# EAGLE design M_C_ext_main_cp2102N (EAGLE 9.6.2)
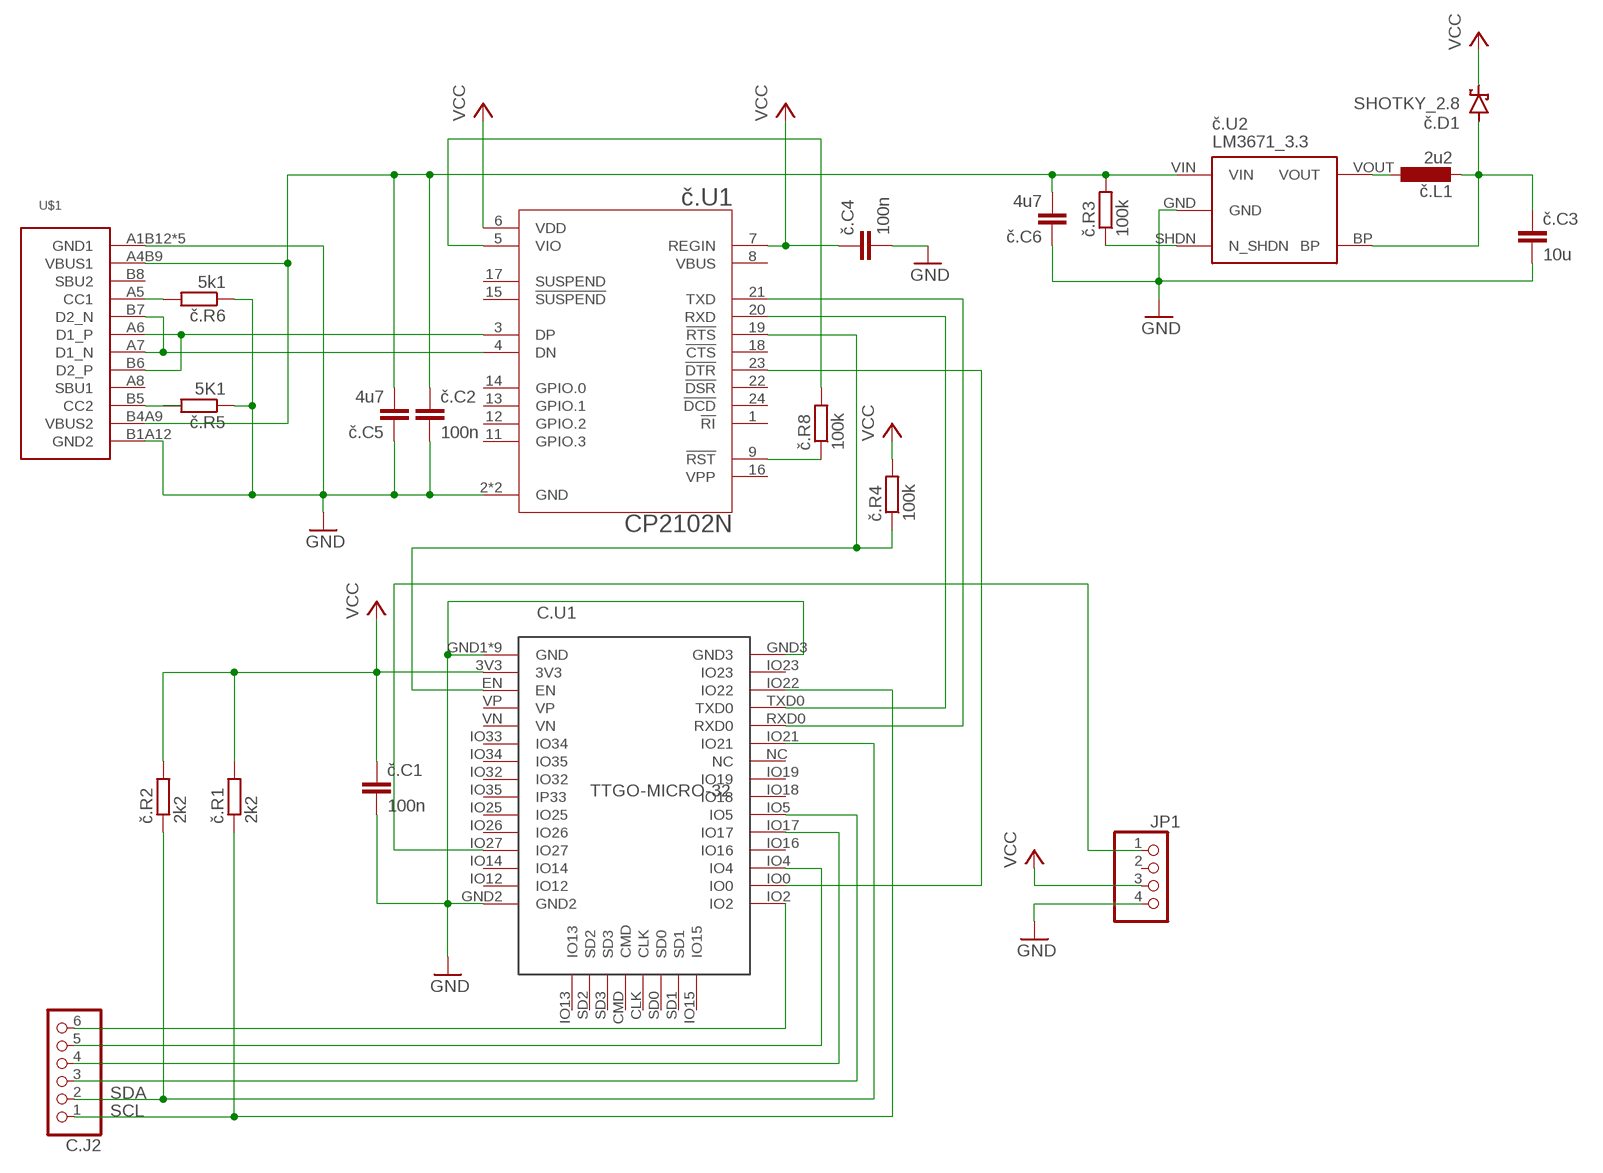
[diagram p0: schematic, sheet 1]

## Parts
C.J2  PINHD-1X6  [1X06]
C.U1  TTGO-MICRO-32  [TTGO-MICRO-32]
JP1  PINHD-1X4  [1X04]
U$1  USB-C  [USB-C]
č.C1  100n  C-EUC0603  [C0603]
č.C2  100n  C-EUC0603  [C0603]
č.C3  10u  C-EUC0805  [C0805]
č.C4  100n  C-EUC0603  [C0603]
č.C5  4u7  C-EUC0603  [C0603]
č.C6  4u7  C-EUC0603  [C0603]
č.D1  SHOTKY_2.8  [SHOTKY_2.8]
č.L1  2u2  L-EUL3230M  [L3230M]
č.R1  2k2  R-EU_R0603  [R0603]
č.R2  2k2  R-EU_R0603  [R0603]
č.R3  100k  R-EU_R0603  [R0603]
č.R4  100k  R-EU_R0603  [R0603]
č.R5  5K1  R-EU_R0603  [R0603]
č.R6  5k1  R-EU_R0603  [R0603]
č.R8  100k  R-EU_R0603  [R0603]
č.U1  CP2102N  CP2104-F03-GM  [QFN50P400X400X80-25N]
č.U2  LM3671_3.3  STABILISER_APE8865  [SOT32-5]

## Nets
GND: C.U1.GND1(GND) C.U1.GND2 C.U1.GND3 C.U1.GND4(GND) C.U1.GND5(GND) C.U1.GND6(GND) C.U1.GND7(GND) C.U1.GND8(GND) C.U1.GND9(GND) C.U1.GND10(GND) C.U1.GND11(GND) JP1.4 U$1.A1B12(GND1) U$1.B1A12(GND2) U$1.SH1(GND1) U$1.SH2(GND1) U$1.SH3(GND1) U$1.SH4(GND1) č.C1.2 č.C2.2 č.C3.2 č.C4.2 č.C5.1 č.C6.1 č.R5.1 č.R6.1 č.U1.2(GND) č.U1.25(GND) č.U2.GND
N$1: U$1.A7(D1_N) U$1.B7(D2_N) č.U1.4(DN)
N$2: U$1.A6(D1_P) U$1.B6(D2_P) č.U1.3(DP)
N$3: U$1.A5(CC1) č.R6.2
N$4: U$1.B5(CC2) č.R5.2
N$5: č.C3.1 č.D1.A č.L1.2 č.U2.BP
N$6: C.J2.6 C.U1.IO2
N$7: C.U1.IO27 JP1.1
N$8: č.R8.2 č.U1.5(VIO)
N$10: č.L1.1 č.U2.VOUT
N$11: č.R3.1 č.U2.SHDN(N_SHDN)
N$12: C.J2.5 C.U1.IO4
N$13: C.J2.4 C.U1.IO17
N$14: C.J2.3 C.U1.IO5
N$16: č.R8.1 č.U1.9(!RST!)
PROG: C.U1.IO0 č.U1.23(!DTR)
RESET: C.U1.EN č.R4.1 č.U1.19(!RTS)
RX: C.U1.TXD0 č.U1.20(RXD)
SCL: C.J2.1 C.U1.IO22 č.R1.1
SDA: C.J2.2 C.U1.IO21 č.R2.1
TX: C.U1.RXD0 č.U1.21(TXD)
VCC: C.U1.3V3 JP1.3 č.C1.1 č.C4.1 č.D1.K(C) č.R1.2 č.R2.2 č.R4.2 č.U1.6(VDD) č.U1.7(REGIN)
VUSB: U$1.A4B9(VBUS1) U$1.B4A9(VBUS2) č.C2.1 č.C5.2 č.C6.2 č.R3.2 č.U2.VIN
Unconnected: C.U1.CLK C.U1.CMD C.U1.IO12 C.U1.IO13 C.U1.IO14 C.U1.IO15 C.U1.IO16 C.U1.IO18 C.U1.IO19 C.U1.IO23 C.U1.IO25 C.U1.IO26 C.U1.IO32 C.U1.IO33(IO34) C.U1.IO34(IO35) C.U1.IO35(IP33) C.U1.NC C.U1.SD0 C.U1.SD1 C.U1.SD2 C.U1.SD3 C.U1.VN C.U1.VP JP1.2 U$1.A8(SBU1) U$1.B8(SBU2) č.U1.1(!RI) č.U1.8(VBUS) č.U1.11(GPIO.3) č.U1.12(GPIO.2) č.U1.13(GPIO.1) č.U1.14(GPIO.0) č.U1.15(!SUSPEND!) č.U1.16(VPP) č.U1.17(SUSPEND) č.U1.18(!CTS) č.U1.22(!DSR) č.U1.24(!DCD)

## Library data of the parts
C.J2 = pinhead2:PINHD-1X6: PIN HEADER
C.U1 = hugo:TTGO-MICRO-32
JP1 = pinhead2:PINHD-1X4: PIN HEADER
U$1 = hugo:USB-C
č.C1-č.C6 = rcl:C-EU: CAPACITOR, European symbol; SPICEPREFIX: C
č.D1 = hugo:SHOTKY_2.8
č.L1 = rcl:L-EU: INDUCTOR, European symbol; SPICEPREFIX: L
č.R1-č.R6 č.R8 = rcl:R-EU_: RESISTOR, European symbol; SPICEPREFIX: R
č.U1 = CP2104:CP2104: Silabs CP2104 USB to UART Bridge; AVAILABILITY: Unavailable; DESCRIPTION: USB Bridge, USB to UART USB 2.0 UART Interface 24-QFN (4x4); MF: Silicon Labs; MP: CP2104; PACKAGE: QFN-24 Silicon Labs; PRICE: None
č.U2 = !stavebnice03:STABILISER_APE8865

## Board
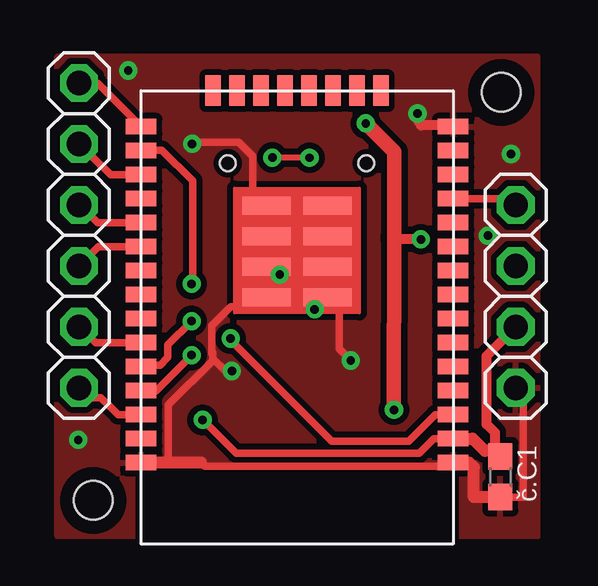
[diagram p1: board, top side]
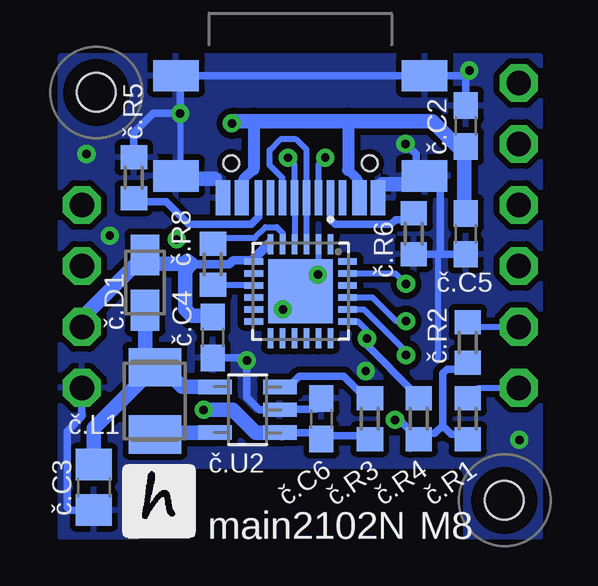
[diagram p2: board, bottom side, seen from below]

No outline drawn. Coordinates in mm, seen from the top.
Copper layers (1*16): Top 0.035mm / dielectric 1.5mm / Bottom 0.035mm
Design rules "default *": minimum track width 10mil, minimum drill 0.35mm, track to track 6mil, track to pad 6mil, pad to pad 6mil, via to via 10mil, smd to smd 10mil, copper to edge 10mil, drill to drill 40mil, minimum pad ring 10mil, minimum via ring 8mil, stop-mask expansion 4mil, vias tented up to drill 0.4mm, thermal gap 10mil
Holes 1.6 mm at 2,2 19,19
tRestrict: area 18,18 to 20,20; area 1,1 to 3,3
bRestrict: area 1,1 to 3,3; area 18,18 to 20,20

### Footprints (pad centres in the part's own frame; a part is rotated, then mirrored left to right if it is on the bottom)
1X06 = drill 1.016 pad 1.575 octagon: 1 -6.35,0; 2 -3.81,0; 3 -1.27,0; 4 1.27,0; 5 3.81,0; 6 6.35,0
TTGO-MICRO-32 = smd 1.27 x 0.635: 3V3 -6.5,5; EN -6.5,4; GND1 -6.5,6; GND2 -6.5,-8; GND3 6.5,6; IO0 6.5,-7; IO2 6.5,-8; IO4 6.5,-6; IO5 6.5,-3; IO12 -6.5,-7; IO14 -6.5,-6; IO16 6.5,-5; IO17 6.5,-4; IO18 6.5,-2; IO19 6.5,-1; IO21 6.5,1; IO22 6.5,4; IO23 6.5,5; IO25 -6.5,-3; IO26 -6.5,-4; IO27 -6.5,-5; IO32 -6.5,-1; IO33 -6.5,-2; IO34 -6.5,1; IO35 -6.5,0; NC 6.5,0; RXD0 6.5,2; TXD0 6.5,3; VN -6.5,2; VP -6.5,3 | smd 0.635 x 1.27: CLK 0.5,-9.5; CMD -0.5,-9.5; IO13 -3.5,-9.5; IO15 3.5,-9.5; SD0 1.5,-9.5; SD1 2.5,-9.5; SD2 -2.5,-9.5; SD3 -1.5,-9.5 | smd 2.032 x 0.762: GND4 -1.27,-0.889; GND5 1.27,-0.889; GND6 -1.27,-2.159; GND7 1.27,-2.159; GND8 -1.27,-3.429; GND9 -1.27,-4.699; GND10 1.27,-3.429; GND11 1.27,-4.699
1X04 = drill 1.016 pad 1.575 octagon: 1 -3.81,0; 2 -1.27,0; 3 1.27,0; 4 3.81,0
USB-C = smd 0.6 x 1.45: A1B12 -3.235,3.825; A4B9 -2.46,3.825; B1A12 3.215,3.825; B4A9 2.44,3.825 | smd 0.3 x 1.45: A5 -1.26,3.825; A6 -0.26,3.825; A7 0.24,3.825; A8 1.24,3.825; B5 1.74,3.825; B6 0.74,3.825; B7 -0.76,3.825; B8 -1.76,3.825 | smd 1.9 x 1.3: SH1 -5.18,2.91; SH2 -5.18,-1.27; SH3 5.18,-1.27; SH4 5.18,2.91 | hole 0.65: 2.88,2.38; -2.9,2.38
C0603 = smd 1.1 x 1: 1 -0.85,0; 2 0.85,0
C0805 = smd 1.3 x 1.5: 1 -0.95,0; 2 0.95,0
SHOTKY_2.8 = smd 1.7 x 1.2: A -1.15,0; K 1.15,0
L3230M = smd 1.6 x 2.2: 1 -1.4,0; 2 1.4,0
R0603 = smd 1 x 1.1: 1 -0.85,0; 2 0.85,0
QFN50P400X400X80-25N = smd 0.81 x 0.26: 1 -1.955,1.25; 2 -1.955,0.75; 3 -1.955,0.25; 4 -1.955,-0.25; 5 -1.955,-0.75; 6 -1.955,-1.25; 13 1.955,-1.25; 14 1.955,-0.75; 15 1.955,-0.25; 16 1.955,0.25; 17 1.955,0.75; 18 1.955,1.25 | smd 0.26 x 0.81: 7 -1.25,-1.955; 8 -0.75,-1.955; 9 -0.25,-1.955; 10 0.25,-1.955; 11 0.75,-1.955; 12 1.25,-1.955; 19 1.25,1.955; 20 0.75,1.955; 21 0.25,1.955; 22 -0.25,1.955; 23 -0.75,1.955; 24 -1.25,1.955 | smd 2.68 x 2.68: 25 0,0
SOT32-5 = smd 0.6 x 1.4: BP 0.95,1.35; GND 0,-1.35; SHDN 0.95,-1.35; VIN -0.95,-1.35; VOUT -0.95,1.35

### Placement (x,y rotation side)
C.J2  1.4,13.04 90 top
C.U1  10.49,9.58 180 top
JP1  19.6,10.5 270 top
U$1  10.5,18.43 180 bottom
č.C1  18.96,2.98 270 top
č.C2  3.6,17.6 90 bottom
č.C3  19.1,2.55 270 bottom
č.C4  14.15,8.79 270 bottom
č.C5  3.6,13.11 90 bottom
č.C6  9.63,5.4 270 bottom
č.D1  16.97,11.07 90 bottom
č.L1  16.56,6.15 90 bottom
č.R1  3.52,5.4 270 bottom
č.R2  3.52,8.58 270 bottom
č.R3  7.6,5.4 270 bottom
č.R4  5.56,5.4 270 bottom
č.R5  17.43,15.44 270 bottom
č.R6  5.77,13.11 90 bottom
č.R8  14.14,11.84 90 bottom
č.U1  10.49,10.71 270 bottom
č.U2  12.7,5.78 90 bottom

### Tracks (layer width: path | path; a pad name or v marks a point on that pad's centre or on a via)
GND  (via drill 0.35)
  Top 0.254: 9.75,10.46 10.13,10.84 10.47,10.84 11.1,10.21 | 9.42,10.46 9.17,10.21 | C.U1.GND9 C.U1.GND8
  Top 0.305: 15.65,17.63 15.51,17.77 v15.51,18.12 15.51,17.97 | 16.94,17.63 C.U1.GND2 | C.U1.GND3 | 6.21,16.94 v6.12,16.86 6.18,16.92 8.06,16.92 8.65,16.33 8.65,14.79 9.73,13.71 9.73,12.76 9.73,11.43 9.73,10.13 | 18.96,2.15 č.C1.2 19.91,2.13 19.91,6.38 JP1.4 | 11.2,11.6 9.73,10.13 | C.U1.GND1 16.88,3.46 16.85,3.46 16.75,3.57 16.59,3.57 16.44,3.41 6.65,3.41 6.49,3.57 | 9.73,10.13 9.73,10.06 7.72,10.06 6.93,9.27 6.93,8.12 6.98,8.18 | 12.32,10.26 12.24,10.26 | 12.24,10.26 11.15,10.26 11.1,10.21 9.17,10.21 | 9.75,10.46 9.42,10.46 C.U1.GND5 | 12.04,12.73 C.U1.GND8 | C.U1.GND6 11.76,12.45 12.04,12.73 | 12.04,12.73 12.06,12.75 | 12.24,10.26 12.24,8.31 v12.72,7.83 | v7.77,7.39 7.49,7.39 6.99,7.9 6.99,8.18 6.98,8.18 | 6.98,8.18 6.98,7.83 5.13,5.98 5.13,3.65 5.21,3.57
  Top 0.406: 16.94,17.63 15.65,17.63
  Top 0.508: 6.49,3.57 5.21,3.57 C.U1.GND3 | č.C1.2 17.86,2.13 17.86,3.38 17.66,3.58 C.U1.GND1 16.95,3.61 | C.U1.GND10 9.48,13.01 9.73,12.76 | C.U1.GND7 9.42,11.73 9.73,11.43
  Bottom 0.254: v15.51,18.12 15.51,15.57 U$1.SH4 | č.U1.2 9.73,12.66 9.74,11.4 v9.77,11.4 9.8,11.4 č.U1.25 10.79,11.01 | č.R6.1 5.61,12.26 4.91,12.26 4.75,12.2 4.75,7.94
  Bottom 0.305: 15.49,18.12 v15.51,18.12 | U$1.A1B12 7.26,15.01 7.24,15.01 | 7.09,15.18 7.09,15.01 7.24,15.01 | 7.24,15.01 7.24,14.82 | v6.12,16.86 5.68,16.42 5.68,15.4 | v15.51,18.12 15.51,19.65 U$1.SH3 U$1.SH2 3.67,19.7 v3.45,19.91 3.54,19.83 3.53,19.72 3.6,19.65 č.C2.2 | 15.32,15.52 U$1.SH4 15.37,15.52 15.24,15.39 | 5.76,15.18 U$1.SH1 4.99,15.52 4.67,15.21 4.67,12.26 č.C5.1 3.62,12.24 | 10.7,10.91 č.U1.25 | 10.79,11.01 10.27,11.54 | JP1.4 19.6,5.5 20.21,4.89 20.21,1.71 20.09,1.59 č.C3.2 | 15.56,18.07 v15.51,18.12 | U$1.B1A12 13.71,15.05 14.06,15.39 | 4.72,12.26 5.61,12.26 | 5.61,12.26 | v15.51,18.12 16.62,18.12 17.43,17.31 č.R5.1 | č.C4.2 12.72,7.94 12.84,7.83 v12.72,7.83 12.72,6.29 12.21,5.78 č.U2.GND 11.32,5.8 9.86,5.8 9.63,6.03 č.C6.1
  Bottom 0.508: č.U1.25 10.56,10.64 10.92,10.64
  Bottom 0.61: 14.06,15.39 15.24,15.39 | 5.76,15.18 7.09,15.18
  other vias: 11.22,9.96 1.37,4.52 19.41,16.43 18.44,13.03
  pour Top (isolate 0.254): 0.5,0.5 0.5,20.5 20.5,20.5 20.5,0.5
  pour Bottom (isolate 0.254): 0.5,20.5 20.5,20.5 20.5,0.5 0.5,0.5
N$1  (via drill 0.35)
  Top 0.254: v11.01,16.28 v9.46,16.28
  Top 0.305: v11.01,16.28
  Bottom 0.254: U$1.B7 9.74,15.99 9.72,16.02 v9.46,16.28 | U$1.A7 10.74,16 v11.01,16.28 | U$1.A7 | U$1.A7 10.74,14.91 | U$1.A7 č.U1.4 | č.U1.4
N$2
  Bottom 0.254: č.U1.3 U$1.A6 10.24,16.61 10.68,17.04 11.33,17.04 11.78,16.59 11.78,15.97 11.25,15.44 11.25,14.61 U$1.B6
N$3
  Bottom 0.305: U$1.A5 9.25,13.7 9.04,13.5 6.74,13.5 6.53,13.7 6.03,13.7 č.R6.2
N$4
  Bottom 0.254: U$1.B5 12.24,13.81
  Bottom 0.305: 12.24,13.81 12.54,13.51 15.15,13.51 16.08,14.44 17.28,14.44 č.R5.2
N$5
  Bottom 0.61: 16.07,8.03 č.L1.2 | č.L1.2 16.24,7.55 15.42,6.73 č.U2.BP | č.L1.2 19.1,5 č.C3.1 | č.D1.A 16.97,7.96 č.L1.2
N$6
  Top 0.305: C.U1.IO2 2.18,19.39 C.J2.6
N$7
  Top 0.305: C.U1.IO27 19.33,14.58 JP1.1
N$8
  Bottom 0.254: č.R8.2 13.87,12.94 12.39,12.94 11.94,13.39 11.49,13.39 11.24,13.14 č.U1.5
N$10
  Bottom 0.305: 14.08,4.83 č.U2.VOUT
  Bottom 0.508: č.L1.1 16.49,4.81 | č.U2.VOUT 14.06,4.81
  Bottom 0.61: 16.49,4.81 14.06,4.81
N$11
  Bottom 0.305: č.U2.SHDN 11.04,6.73 11.01,6.69 10.54,7.16 8.68,7.16 7.76,6.24 č.R3.1
N$12
  Top 0.305: C.U1.IO4 2.72,15.58 C.J2.5
N$13
  Top 0.305: C.U1.IO17 2.18,13.58 C.J2.4
N$14
  Top 0.305: C.U1.IO5 2.21,12.58 C.J2.3
N$16
  Bottom 0.254: č.U1.9 14.11,10.96 č.R8.1
PROG  (via drill 0.35)
  Top 0.305: C.U1.IO0 4.32,16.58 4.33,16.59 4.86,16.59 6.13,15.31 6.13,11.06 v6.1,11.02
  Bottom 0.254: č.U1.23 6.54,11.46 v6.1,11.02
RESET  (via drill 0.35)
  Top 0.305: C.U1.EN 16.25,5.58 15.14,4.47 11.93,4.47 7.81,8.59 7.81,8.69 v7.72,8.74
  Bottom 0.254: č.U1.19 8.1,9.46 7.75,9.11 7.75,8.77 v7.72,8.75 v7.72,8.74
  Bottom 0.305: v7.72,8.74 7.74,8.49 5.77,6.51 5.8,6.48 č.R4.1
RX  (via drill 0.35)
  Top 0.305: C.U1.TXD0 4.01,6.56 4.63,6.56 v6.1,8.05
  Bottom 0.254: č.U1.20 7.85,9.96 6.1,8.21 v6.1,8.05
SCL
  Top 0.305: C.U1.IO22 3.04,5.58 2.69,5.93 2.31,6.28 1.81,6.28 C.J2.1
  Bottom 0.254: č.R1.1 3.08,6.69 C.J2.1
SDA
  Top 0.305: C.U1.IO21 2.1,8.58 C.J2.2
  Bottom 0.254: č.R2.1 3.35,9.23 C.J2.2
TX  (via drill 0.35)
  Top 0.305: C.U1.RXD0 4.05,7.64 4.79,7.64 5.11,7.96 5.11,8.48 v6.1,9.46 v6.1,9.47
  Bottom 0.254: č.U1.21 7.49,10.46 6.5,9.47 v6.1,9.47
VCC  (via drill 0.35)
  Top 0.305: 17,4.56 16.19,4.56 15.59,3.96 7.95,3.96 v6.56,5.36
  Top 0.406: 17,4.56 C.U1.3V3 | 18.73,4.06 18.73,4.83 18.39,5.17 18.39,8.02 JP1.3
  Top 0.508: C.U1.3V3 17.8,4.58 18.32,4.06 18.73,4.06 č.C1.1
  Bottom 0.254: 3.71,7.72 č.R2.2 | 3.53,4.58 č.R1.2 3.64,4.69 | 11.74,12.64 č.U1.6 11.77,12.69 11.82,12.69 | č.U1.7 12.5,11.96 12.57,12.04 12.6,12.04 | 12.45,12.06 č.U1.7 | č.U1.7 12.48,12
  Bottom 0.305: č.R2.2 3.76,7.47 4.38,7.47 4.57,7.29 4.57,5.12 | 3.78,4.84 č.R1.2 3.7,4.76 4.2,4.76 4.57,5.12 | 5.92,4.18 č.R4.2 | č.R4.2 5.31,4.79 4.9,4.79 4.57,5.12 | č.R4.2 6.37,5.36 v6.56,5.36
  Bottom 0.356: 12.48,12 13.29,12 13.45,11.83 15.12,11.83
  Bottom 0.406: 12.45,12.06 11.82,12.69
  Bottom 0.61: 15.09,11.86 15.22,11.98 | č.C4.1 14.21,9.7 15.03,9.7 15.3,9.97 15.3,11.55 15.22,11.62 15.22,11.68 | 15.04,11.86 15.22,11.68 | 15.3,11.88 15.3,11.65 15.22,11.73 | 15.22,11.68 15.22,11.73 | 15.22,11.73 15.12,11.83 15.09,11.86 | 15.09,11.86 16.6,11.86 č.D1.K 19.6,9.59 JP1.3
VUSB  (via drill 0.35)
  Top 0.406: v15.65,12.88 | v15.65,12.88 14.54,12.88
  Top 0.61: v13.35,17.71 13.36,17.71 14.54,16.52 14.54,13.01 | 14.54,13.01 14.54,12.88 | 14.54,13.01 v14.53,5.77 | v14.53,5.77
  Bottom 0.254: 11.28,4.89 č.U2.VIN
  Bottom 0.305: U$1.B4A9 12.89,14.65 | U$1.A4B9 8.12,14.68 | č.C2.1 3.75,16.75 | č.U2.VIN 9.92,4.83 č.C6.2 9.47,4.69 7.75,4.69 č.R3.2
  Bottom 0.356: č.C2.1 3.67,16.73 3.67,16.42
  Bottom 0.406: 12.89,14.65 12.89,15.35 12.45,15.79 | 8.12,14.68 8.12,15.38 8.51,15.77
  Bottom 0.508: 8.51,17.8 8.51,15.77 | 12.45,17.8 12.45,15.79 | č.U2.VIN 11.27,4.75
  Bottom 0.61: 3.81,13.85 č.C5.2 3.67,13.98 3.67,16.42 | v13.35,17.71 13.26,17.8 12.45,17.8 8.51,17.8 5.01,17.8 3.96,16.75 č.C2.1 | v14.53,5.77 13.31,5.77 12.35,4.82 11.36,4.82 č.U2.VIN

### Text on the board
bPlace: M8 | main2102N